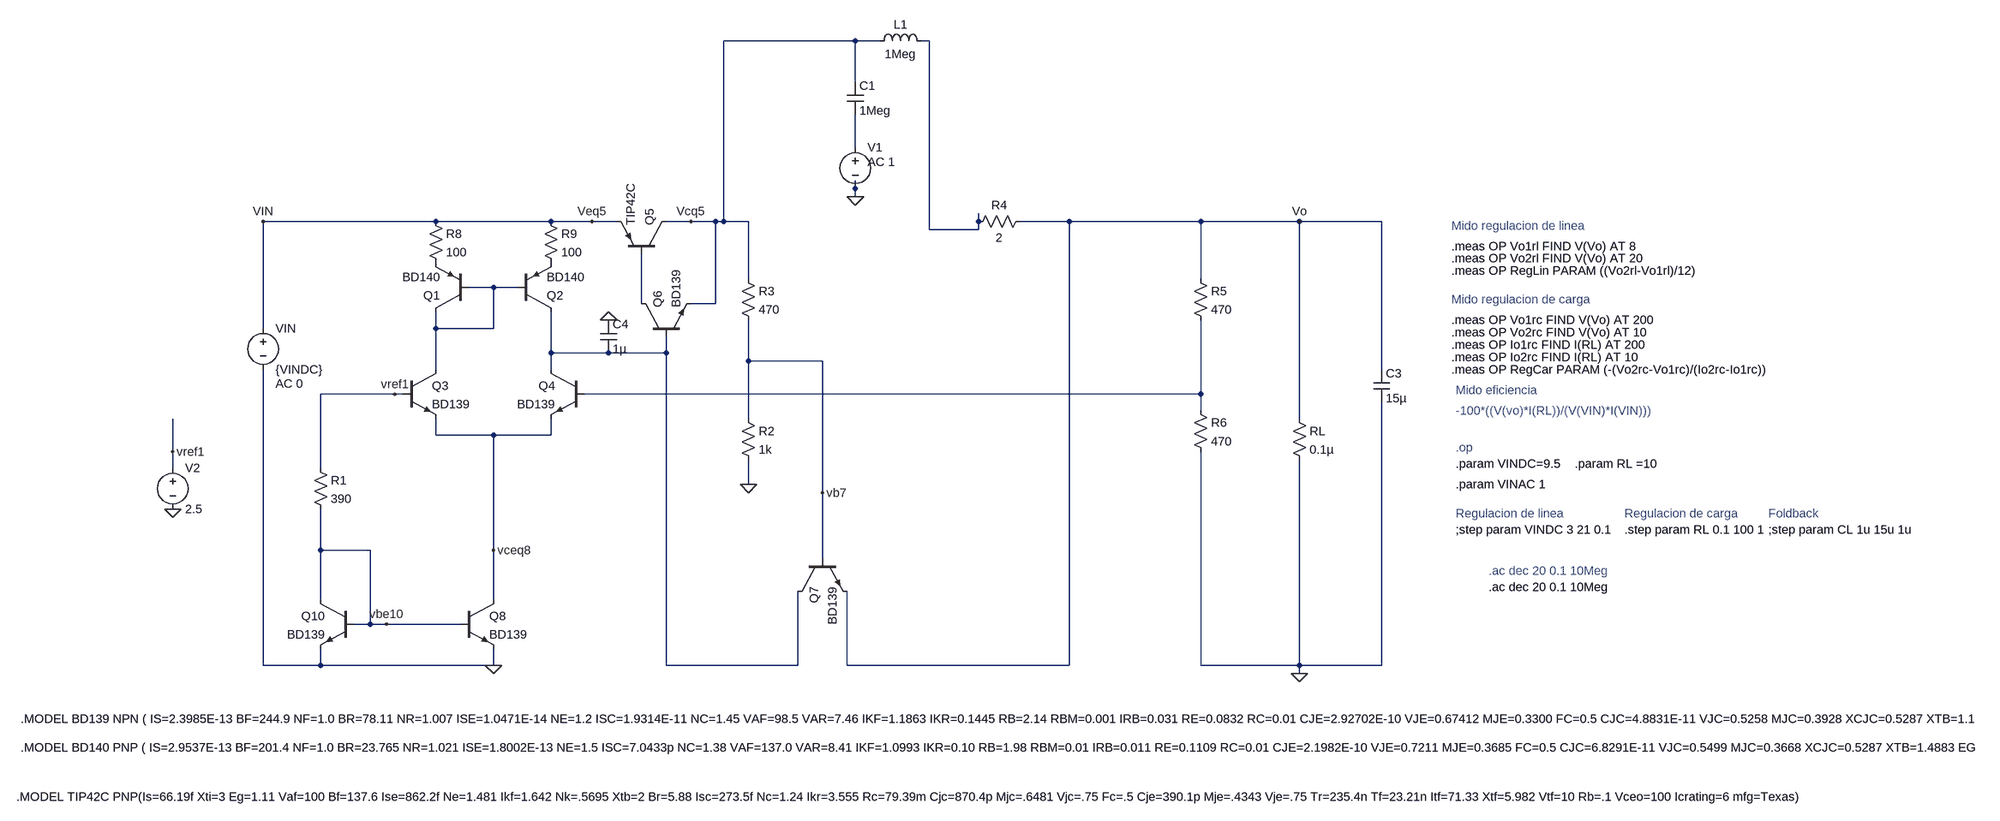
[diagram p0: schematic regulador_lineal_compensado_corriente.asc]
regulador_lineal_compensado_corriente.asc, the LTspice schematic file:
Version 4.1
SHEET 1 4052 1104
WIRE 912 -384 656 -384
WIRE 960 -384 912 -384
WIRE 1056 -384 1040 -384
WIRE 912 -304 912 -384
WIRE 912 -176 912 -240
WIRE 912 -96 912 -112
WIRE 912 -80 912 -96
WIRE 96 -32 -240 -32
WIRE 320 -32 96 -32
WIRE 400 -32 320 -32
WIRE 448 -32 400 -32
WIRE 592 -32 544 -32
WIRE 640 -32 592 -32
WIRE 656 -32 656 -384
WIRE 656 -32 640 -32
WIRE 704 -32 656 -32
WIRE 1152 -32 1152 -48
WIRE 1328 -32 1232 -32
WIRE 1584 -32 1328 -32
WIRE 1776 -32 1584 -32
WIRE 1936 -32 1776 -32
WIRE 1056 -16 1056 -384
WIRE 1152 -16 1152 -32
WIRE 1152 -16 1056 -16
WIRE 704 80 704 -32
WIRE 1584 80 1584 -32
WIRE 208 96 160 96
WIRE 256 96 208 96
WIRE 496 128 496 32
WIRE 640 128 640 -32
WIRE 640 128 592 128
WIRE -240 176 -240 -32
WIRE 96 176 96 144
WIRE 208 176 208 96
WIRE 208 176 96 176
WIRE 320 224 320 144
WIRE 432 224 320 224
WIRE 544 224 544 192
WIRE 544 224 432 224
WIRE 704 240 704 160
WIRE 848 240 704 240
WIRE 96 256 96 176
WIRE 320 256 320 224
WIRE 1936 256 1936 -32
WIRE 16 304 -128 304
WIRE 32 304 16 304
WIRE 1584 304 1584 160
WIRE 1584 304 384 304
WIRE 1584 336 1584 304
WIRE 704 352 704 240
WIRE 1776 352 1776 -32
WIRE 96 384 96 352
WIRE 208 384 96 384
WIRE 320 384 320 352
WIRE 320 384 208 384
WIRE -416 416 -416 352
WIRE -416 448 -416 416
WIRE -128 448 -128 304
WIRE 704 480 704 432
WIRE 848 496 848 240
WIRE -128 608 -128 528
WIRE -32 608 -128 608
WIRE 208 608 208 384
WIRE 848 624 848 496
WIRE -128 704 -128 608
WIRE 208 704 208 608
WIRE -32 752 -32 608
WIRE -32 752 -64 752
WIRE 0 752 -32 752
WIRE 144 752 0 752
WIRE -240 832 -240 256
WIRE -128 832 -128 800
WIRE -128 832 -240 832
WIRE 208 832 208 800
WIRE 208 832 -128 832
WIRE 544 832 544 224
WIRE 800 832 800 688
WIRE 800 832 544 832
WIRE 896 832 896 688
WIRE 1328 832 1328 -32
WIRE 1328 832 896 832
WIRE 1584 832 1584 416
WIRE 1776 832 1776 432
WIRE 1776 832 1584 832
WIRE 1936 832 1936 320
WIRE 1936 832 1776 832
WIRE 1776 848 1776 832
FLAG 1776 -32 Vo
FLAG -240 -32 VIN
FLAG 1776 848 0
FLAG 208 832 0
FLAG 704 480 0
FLAG 0 752 vbe10
FLAG -416 416 vref1
FLAG -416 528 0
FLAG 16 304 vref1
FLAG 208 608 vceq8
FLAG 400 -32 Veq5
FLAG 592 -32 Vcq5
FLAG 848 496 vb7
FLAG 912 -80 0
FLAG 432 160 0
SYMBOL pnp 160 144 R180
SYMATTR InstName Q1
SYMATTR Value BD140
SYMBOL pnp 256 144 M180
SYMATTR InstName Q2
SYMATTR Value BD140
SYMBOL npn 32 256 R0
SYMATTR InstName Q3
SYMATTR Value BD139
SYMBOL npn 384 256 M0
SYMATTR InstName Q4
SYMATTR Value BD139
SYMBOL pnp 544 32 M270
SYMATTR InstName Q5
SYMATTR Value TIP42C
SYMBOL npn 496 192 R270
SYMATTR InstName Q6
SYMATTR Value BD139
SYMBOL voltage -240 160 R0
WINDOW 123 24 124 Left 2
WINDOW 39 0 0 Left 0
SYMATTR Value2 AC 0
SYMATTR InstName VIN
SYMATTR Value {VINDC}
SYMBOL res 80 -48 R0
SYMATTR InstName R8
SYMATTR Value 100
SYMBOL res 304 -48 R0
SYMATTR InstName R9
SYMATTR Value 100
SYMBOL cap 1920 256 R0
SYMATTR InstName C3
SYMATTR Value 15µ
SYMBOL res 688 64 R0
SYMATTR InstName R3
SYMATTR Value 470
SYMBOL res 688 336 R0
SYMATTR InstName R2
SYMATTR Value 1k
SYMBOL npn 800 624 M90
SYMATTR InstName Q7
SYMATTR Value BD139
SYMBOL res 1568 64 R0
SYMATTR InstName R5
SYMATTR Value 470
SYMBOL res 1568 320 R0
SYMATTR InstName R6
SYMATTR Value 470
SYMBOL npn 144 704 R0
SYMATTR InstName Q8
SYMATTR Value BD139
SYMBOL npn -64 704 M0
SYMATTR InstName Q10
SYMATTR Value BD139
SYMBOL res 1760 336 R0
SYMATTR InstName RL
SYMATTR Value 0.1µ
SYMBOL res -144 432 R0
SYMATTR InstName R1
SYMATTR Value 390
SYMBOL voltage -416 432 R0
WINDOW 123 24 124 Left 2
WINDOW 39 0 0 Left 0
SYMATTR InstName V2
SYMATTR Value 2.5
SYMBOL ind 944 -368 R270
WINDOW 0 32 56 VTop 2
WINDOW 3 5 56 VBottom 2
SYMATTR InstName L1
SYMATTR Value 1Meg
SYMBOL cap 896 -304 R0
SYMATTR InstName C1
SYMATTR Value 1Meg
SYMBOL cap 416 160 R0
SYMATTR InstName C4
SYMATTR Value 1µ
SYMBOL res 1248 -48 R90
WINDOW 0 0 56 VBottom 2
WINDOW 3 32 56 VTop 2
SYMATTR InstName R4
SYMATTR Value 2
SYMBOL voltage 912 -192 R0
WINDOW 123 24 44 Left 2
WINDOW 39 0 0 Left 0
SYMATTR InstName V1
SYMATTR Value ""
SYMATTR Value2 AC 1
TEXT 2072 -24 Left 2 ;Mido regulacion de linea
TEXT 2072 16 Left 2 !.meas OP Vo1rl FIND V(Vo) AT 8
TEXT 2072 40 Left 2 !.meas OP Vo2rl FIND V(Vo) AT 20
TEXT 2072 64 Left 2 !.meas OP RegLin PARAM ((Vo2rl-Vo1rl)/12)
TEXT 2072 120 Left 2 ;Mido regulacion de carga
TEXT 2072 160 Left 2 !.meas OP Vo1rc FIND V(Vo) AT 200
TEXT 2072 184 Left 2 !.meas OP Vo2rc FIND V(Vo) AT 10
TEXT 2072 208 Left 2 !.meas OP Io1rc FIND I(RL) AT 200
TEXT 2072 232 Left 2 !.meas OP Io2rc FIND I(RL) AT 10
TEXT 2080 296 Left 2 ;Mido eficiencia
TEXT 2080 336 Left 2 ;-100*((V(vo)*I(RL))/(V(VIN)*I(VIN)))
TEXT 2080 440 Left 2 !.param VINDC=9.5
TEXT 2080 480 Left 2 !.param VINAC 1
TEXT 2072 256 Left 2 !.meas OP RegCar PARAM (-(Vo2rc-Vo1rc)/(Io2rc-Io1rc))
TEXT 2080 568 Left 2 !;step param VINDC 3 21 0.1
TEXT -712 936 Left 2 !.MODEL BD139 NPN ( IS=2.3985E-13 BF=244.9 NF=1.0 BR=78.11 NR=1.007 ISE=1.0471E-14 NE=1.2 ISC=1.9314E-11 NC=1.45 VAF=98.5 VAR=7.46 IKF=1.1863 IKR=0.1445 RB=2.14 RBM=0.001 IRB=0.031 RE=0.0832 RC=0.01 CJE=2.92702E-10 VJE=0.67412 MJE=0.3300 FC=0.5 CJC=4.8831E-11 VJC=0.5258 MJC=0.3928 XCJC=0.5287 XTB=1.1398 EG=1.2105 XTI=3.0 Vceo=80 Icrating=3 mfg=fairchild)
TEXT -712 992 Left 2 !.MODEL BD140 PNP ( IS=2.9537E-13 BF=201.4 NF=1.0 BR=23.765 NR=1.021 ISE=1.8002E-13 NE=1.5 ISC=7.0433p NC=1.38 VAF=137.0 VAR=8.41 IKF=1.0993 IKR=0.10 RB=1.98 RBM=0.01 IRB=0.011 RE=0.1109 RC=0.01 CJE=2.1982E-10 VJE=0.7211 MJE=0.3685 FC=0.5 CJC=6.8291E-11 VJC=0.5499 MJC=0.3668 XCJC=0.5287 XTB=1.4883 EG=1.2343 XTI=3.0 Vceo=80 Icrating=3 mfg=fairchild)
TEXT 2688 568 Left 2 !;step param CL 1u 15u 1u
TEXT 2688 536 Left 2 ;Foldback
TEXT 2312 440 Left 2 !.param RL =10
TEXT 2080 536 Left 2 ;Regulacion de linea
TEXT 2408 568 Left 2 !.step param RL 0.1 100 1
TEXT 2408 536 Left 2 ;Regulacion de carga
TEXT -720 1088 Left 2 !.MODEL TIP42C PNP(Is=66.19f Xti=3 Eg=1.11 Vaf=100 Bf=137.6 Ise=862.2f Ne=1.481 Ikf=1.642 Nk=.5695 Xtb=2 Br=5.88 Isc=273.5f Nc=1.24 Ikr=3.555 Rc=79.39m Cjc=870.4p Mjc=.6481 Vjc=.75 Fc=.5 Cje=390.1p Mje=.4343 Vje=.75 Tr=235.4n Tf=23.21n Itf=71.33 Xtf=5.982 Vtf=10 Rb=.1 Vceo=100 Icrating=6 mfg=Texas)
TEXT 2144 648 Left 2 ;.ac dec 20 0.1 10Meg
TEXT 2080 408 Left 2 ;.op
TEXT 2144 680 Left 2 !.ac dec 20 0.1 10Meg

The netlist it stands for:
* regulador_lineal_compensado_corriente.asc
Q1 N003 N003 P001 0 BD140
Q2 N005 N003 P002 0 BD140
Q3 N003 vref1 vceq8 0 BD139
Q4 N005 N006 vceq8 0 BD139
Q5 Vcq5 N004 Veq5 0 TIP42C
Q6 N004 N005 Vcq5 0 BD139
VIN Veq5 0 {VINDC} AC 0
R8 Veq5 P001 100
R9 Veq5 P002 100
C3 Vo 0 15µ
R3 Vcq5 vb7 470
R2 vb7 0 1k
Q7 N005 vb7 Vo 0 BD139
R5 Vo N006 470
R6 N006 0 470
Q8 vceq8 vbe10 0 0 BD139
Q10 vbe10 vbe10 0 0 BD139
RL Vo 0 0.1µ
R1 vref1 vbe10 390
V2 vref1 0 2.5
L1 Vcq5 N001 1Meg
C1 Vcq5 N002 1Meg
C4 0 N005 1µ
R4 Vo N001 2
V1 N002 0 AC 1
.model NPN NPN
.model PNP PNP
.lib standard.bjt
* Mido regulacion de linea
.meas OP Vo1rl FIND V(Vo) AT 8
.meas OP Vo2rl FIND V(Vo) AT 20
.meas OP RegLin PARAM ((Vo2rl-Vo1rl)/12)
* Mido regulacion de carga
.meas OP Vo1rc FIND V(Vo) AT 200
.meas OP Vo2rc FIND V(Vo) AT 10
.meas OP Io1rc FIND I(RL) AT 200
.meas OP Io2rc FIND I(RL) AT 10
* Mido eficiencia
* -100*((V(vo)*I(RL))/(V(VIN)*I(VIN)))
.param VINDC=9.5
.param VINAC 1
.meas OP RegCar PARAM (-(Vo2rc-Vo1rc)/(Io2rc-Io1rc))
;step param VINDC 3 21 0.1
.MODEL BD139 NPN ( IS=2.3985E-13 BF=244.9 NF=1.0 BR=78.11 NR=1.007 ISE=1.0471E-14 NE=1.2 ISC=1.9314E-11 NC=1.45 VAF=98.5 VAR=7.46 IKF=1.1863 IKR=0.1445 RB=2.14 RBM=0.001 IRB=0.031 RE=0.0832 RC=0.01 CJE=2.92702E-10 VJE=0.67412 MJE=0.3300 FC=0.5 CJC=4.8831E-11 VJC=0.5258 MJC=0.3928 XCJC=0.5287 XTB=1.1398 EG=1.2105 XTI=3.0 Vceo=80 Icrating=3 mfg=fairchild)
.MODEL BD140 PNP ( IS=2.9537E-13 BF=201.4 NF=1.0 BR=23.765 NR=1.021 ISE=1.8002E-13 NE=1.5 ISC=7.0433p NC=1.38 VAF=137.0 VAR=8.41 IKF=1.0993 IKR=0.10 RB=1.98 RBM=0.01 IRB=0.011 RE=0.1109 RC=0.01 CJE=2.1982E-10 VJE=0.7211 MJE=0.3685 FC=0.5 CJC=6.8291E-11 VJC=0.5499 MJC=0.3668 XCJC=0.5287 XTB=1.4883 EG=1.2343 XTI=3.0 Vceo=80 Icrating=3 mfg=fairchild)
;step param CL 1u 15u 1u
* Foldback
.param RL =10
* Regulacion de linea
.step param RL 0.1 100 1
* Regulacion de carga
.MODEL TIP42C PNP(Is=66.19f Xti=3 Eg=1.11 Vaf=100 Bf=137.6 Ise=862.2f Ne=1.481 Ikf=1.642 Nk=.5695 Xtb=2 Br=5.88 Isc=273.5f Nc=1.24 Ikr=3.555 Rc=79.39m Cjc=870.4p Mjc=.6481 Vjc=.75 Fc=.5 Cje=390.1p Mje=.4343 Vje=.75 Tr=235.4n Tf=23.21n Itf=71.33 Xtf=5.982 Vtf=10 Rb=.1 Vceo=100 Icrating=6 mfg=Texas)
* .ac dec 20 0.1 10Meg
* .op
.ac dec 20 0.1 10Meg
.backanno
.end